# Altium project sync.PrjPcb
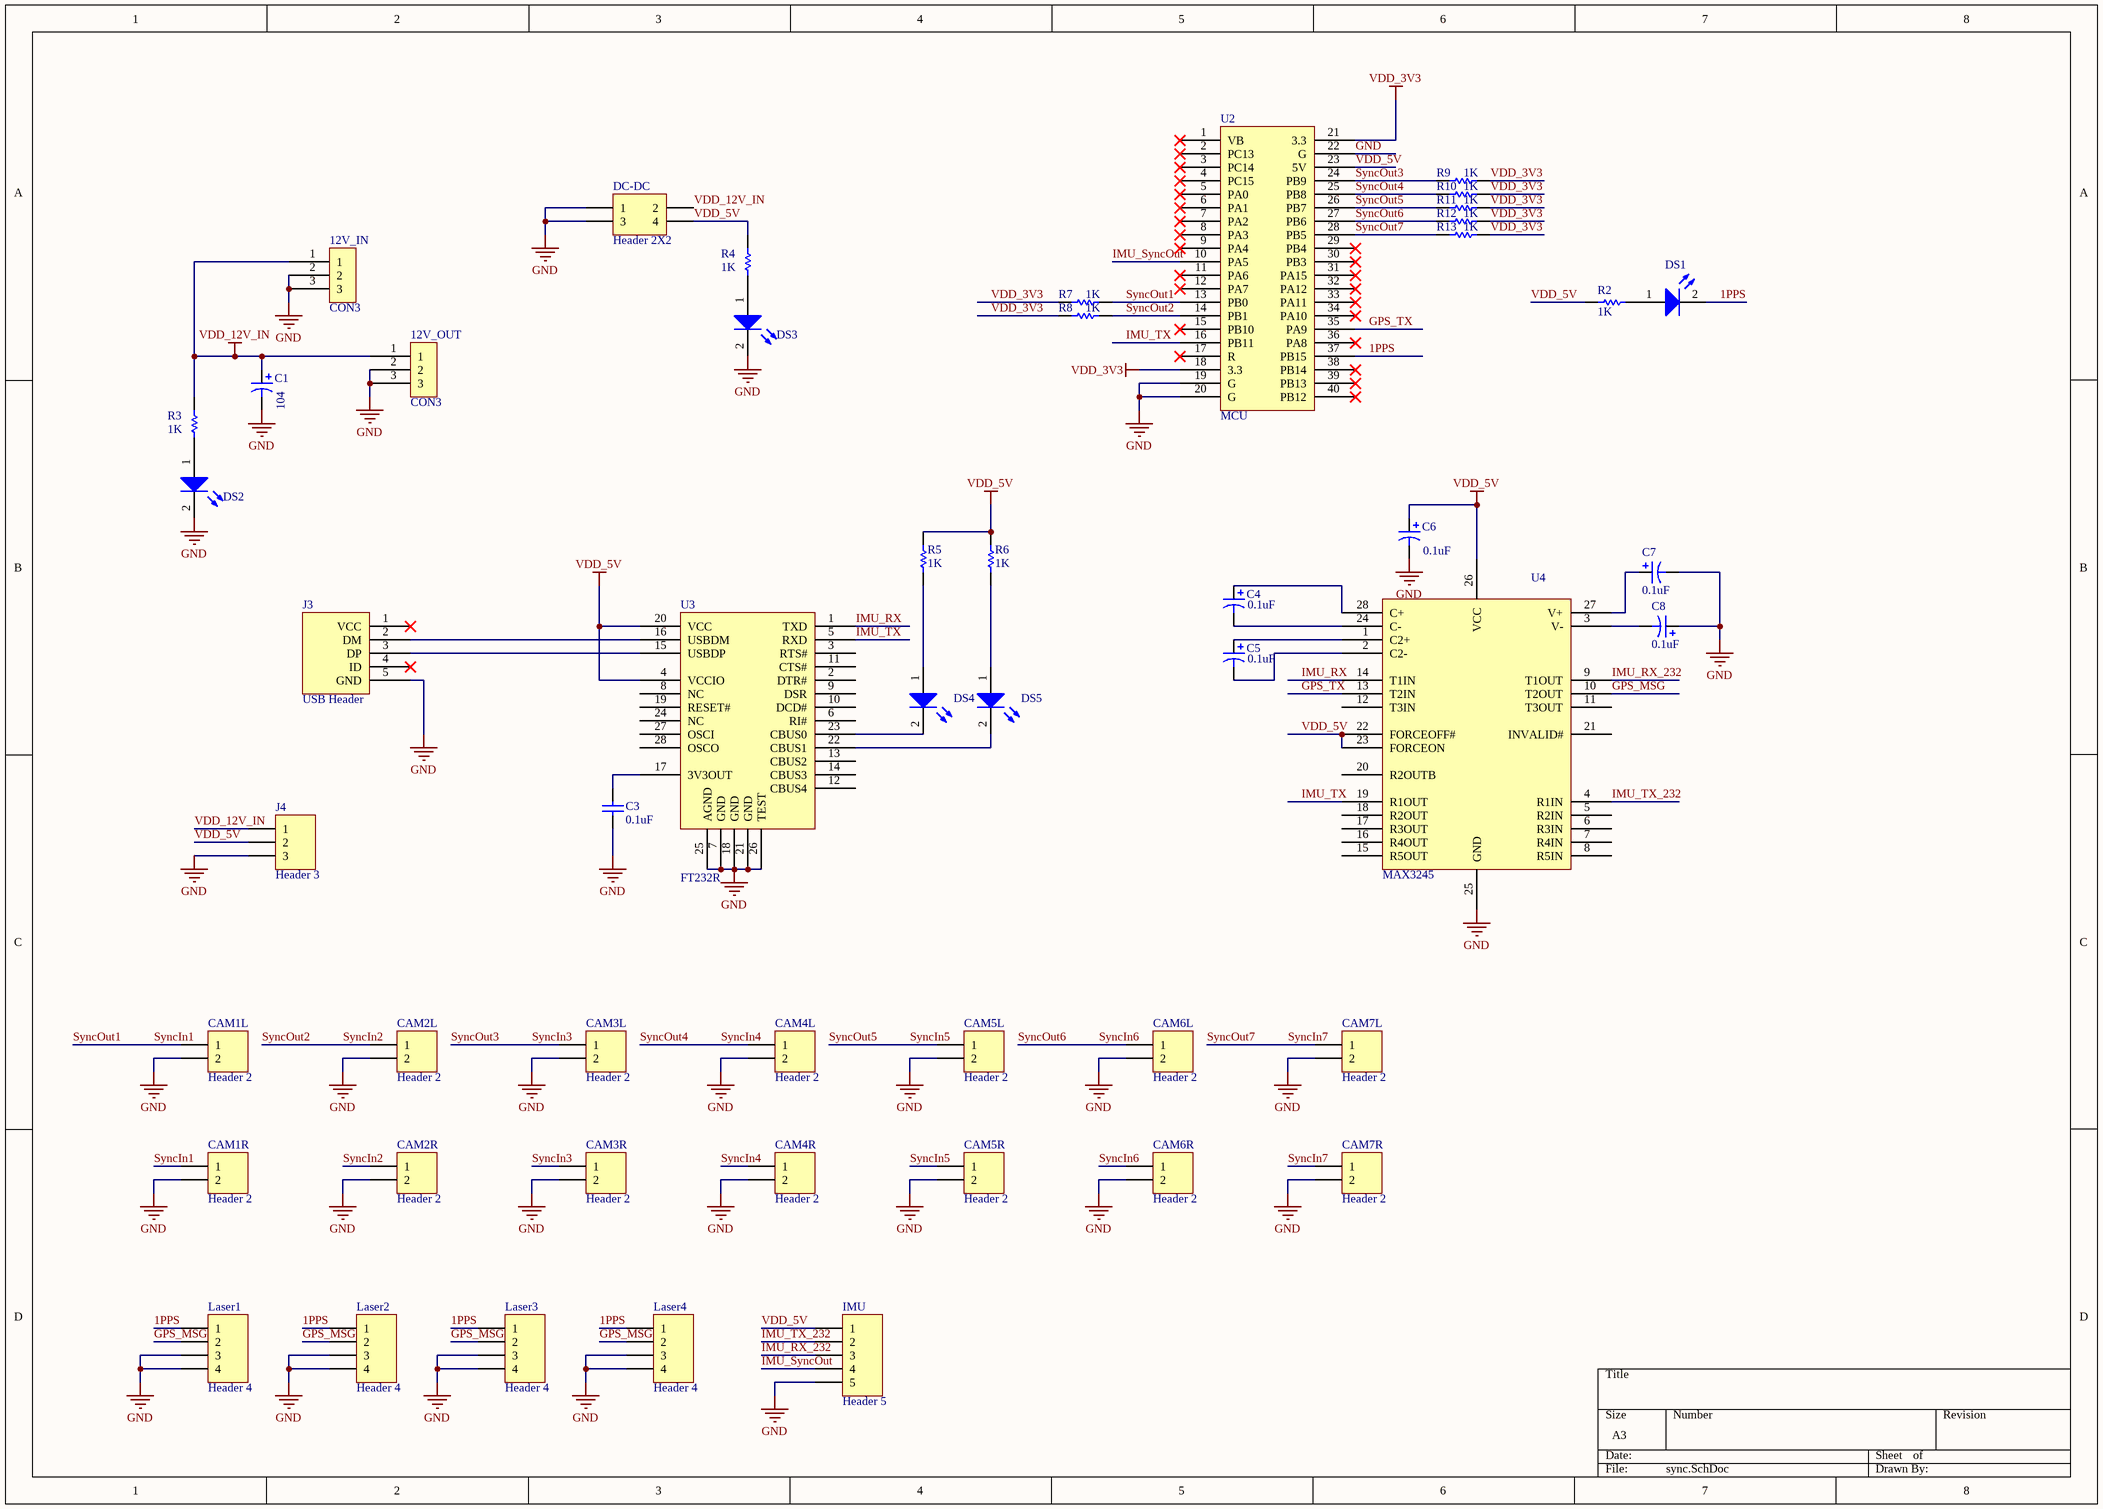
[diagram p0: sync.SchDoc]
1 sheet, 51 parts. Net scope: global (net labels, ports and power ports of the same name join across sheets).
Board file: sync.PcbDoc

## Sheet sync.SchDoc
size A3

### Parts
12V_IN  CON3  [PW_PORT]
12V_OUT  CON3  [PW_PORT]
C1  104  [0805]
C3  0.1uF  [0805C]
C4  0.1uF  [C1206]
C5  0.1uF  [C1206]
C6  0.1uF  [C1206]
C7  0.1uF  [C1206]
C8  0.1uF  [C1206]
CAM1L  Header 2  [1.25mmP2]
CAM1R  Header 2  [1.25mmP2]
CAM2L  Header 2  [1.25mmP2]
CAM2R  Header 2  [1.25mmP2]
CAM3L  Header 2  [1.25mmP2]
CAM3R  Header 2  [1.25mmP2]
CAM4L  Header 2  [1.25mmP2]
CAM4R  Header 2  [1.25mmP2]
CAM5L  Header 2  [1.25mmP2]
CAM5R  Header 2  [1.25mmP2]
CAM6L  Header 2  [1.25mmP2]
CAM6R  Header 2  [1.25mmP2]
CAM7L  Header 2  [1.25mmP2]
CAM7R  Header 2  [1.25mmP2]
DC-DC  Header 2X2  [DC-DC5V_HDR2*2]
DS1  LED2  [0805D]  (value not drawn)
DS2  LED2  [0805D]  (value not drawn)
DS3  LED2  [0805D]  (value not drawn)
DS4  LED2  [0805D]  (value not drawn)
DS5  LED2  [0805D]  (value not drawn)
IMU  Header 5  [1.25mmP5]
J3  USB Header  [USB0.65-5]
J4  Header 3  [HDR1X3]
Laser1  Header 4  [1.25mmP4]
Laser2  Header 4  [1.25mmP4]
Laser3  Header 4  [1.25mmP4]
Laser4  Header 4  [1.25mmP4]
R2  1K  [0805R]
R3  1K  [0805R]
R4  1K  [0805R]
R5  1K  [0805R]
R6  1K  [0805R]
R7  1K  [0805R]
R8  1K  [0805R]
R9  1K  [0805R]
R10  1K  [0805R]
R11  1K  [0805R]
R12  1K  [0805R]
R13  1K  [0805R]
U2  MCU  [STM32Board]
U3  FT232R  [SSOP-28]
U4  MAX3245  [SSOP-28]

### Nets
GND: 12V_IN.2 12V_IN.3 12V_OUT.2 12V_OUT.3 C1.2 C3.1 C6.2 C7.2 C8.1 CAM1L.2 CAM1R.2 CAM2L.2 CAM2R.2 CAM3L.2 CAM3R.2 CAM4L.2 CAM4R.2 CAM5L.2 CAM5R.2 CAM6L.2 CAM6R.2 CAM7L.2 CAM7R.2 DC-DC.1 DC-DC.3 DS2.2(K) DS3.2(K) IMU.5 J3.5(GND) J4.3 Laser1.3 Laser1.4 Laser2.3 Laser2.4 Laser3.3 Laser3.4 Laser4.3 Laser4.4 U2.19(G) U2.20(G) U2.22(G) U3.7(GND) U3.18(GND) U3.21(GND) U3.25(AGND) U3.26(TEST) U4.25(GND)
VDD_3V3: R7.2 R8.2 R9.1 R10.1 R11.1 R12.1 R13.1 U2.18(3.3) U2.21(3.3)
VDD_5V: C6.1 DC-DC.4 IMU.1 J4.2 R2.2 R4.2 R5.1 R6.1 U2.23(5V) U3.4(VCCIO) U3.20(VCC) U4.22(FORCEOFF#) U4.23(FORCEON) U4.26(VCC)
VDD_12V_IN: 12V_IN.1 12V_OUT.1 C1.1 DC-DC.2 J4.1 R3.2
1PPS: DS1.2(K) Laser1.1 Laser2.1 Laser3.1 Laser4.1 U2.37(PB15)
GPS_MSG: Laser1.2 Laser2.2 Laser3.2 Laser4.2 U4.10(T2OUT)
GPS_TX: U2.35(PA9) U4.13(T2IN)
IMU_RX: U3.1(TXD) U4.14(T1IN)
IMU_RX_232: IMU.3 U4.9(T1OUT)
IMU_SyncOut: IMU.4 U2.10(PA5)
IMU_TX: U2.16(PB11) U3.5(RXD) U4.19(R1OUT)
IMU_TX_232: IMU.2 U4.4(R1IN)
SyncIn1: CAM1L.1 CAM1R.1 R7.1 U2.13(PB0)  [also labelled SyncOut1]
SyncIn2: CAM2L.1 CAM2R.1 R8.1 U2.14(PB1)  [also labelled SyncOut2]
SyncIn3: CAM3L.1 CAM3R.1 R9.2 U2.24(PB9)  [also labelled SyncOut3]
SyncIn4: CAM4L.1 CAM4R.1 R10.2 U2.25(PB8)  [also labelled SyncOut4]
SyncIn5: CAM5L.1 CAM5R.1 R11.2 U2.26(PB7)  [also labelled SyncOut5]
SyncIn6: CAM6L.1 CAM6R.1 R12.2 U2.27(PB6)  [also labelled SyncOut6]
SyncIn7: CAM7L.1 CAM7R.1 R13.2 U2.28(PB5)  [also labelled SyncOut7]
NetC3_2: C3.2 U3.17(3V3OUT)
NetC4_1: C4.1 U4.28(C+)
NetC4_2: C4.2 U4.24(C-)
NetC5_1: C5.1 U4.1(C2+)
NetC5_2: C5.2 U4.2(C2-)
NetC7_1: C7.1 U4.27(V+)
NetC8_2: C8.2 U4.3(V-)
NetDS1_1: DS1.1(A) R2.1
NetDS2_1: DS2.1(A) R3.1
NetDS3_1: DS3.1(A) R4.1
NetDS4_1: DS4.1(A) R5.2
NetDS4_2: DS4.2(K) U3.23(CBUS0)
NetDS5_1: DS5.1(A) R6.2
NetDS5_2: DS5.2(K) U3.22(CBUS1)
NetJ3_2: J3.2(DM) U3.16(USBDM)
NetJ3_3: J3.3(DP) U3.15(USBDP)

Not connected (* = marked no-connect by the designer): J3 1(VCC)* 4(ID)*; U2 1(VB)* 2(PC13)* 3(PC14)* 4(PC15)* 5(PA0)* 6(PA1)* 7(PA2)* 8(PA3)* 9(PA4)* 11(PA6)* 12(PA7)* 15(PB10)* 17(R)* 29(PB4)* 30(PB3)* 31(PA15)* 32(PA12)* 33(PA11)* 34(PA10)* 36(PA8)* 38(PB14)* 39(PB13)* 40(PB12)*; U3 2(DTR#) 3(RTS#) 6(RI#) 8(NC) 9(DSR) 10(DCD#) 11(CTS#) 12(CBUS4) 13(CBUS2) 14(CBUS3) 19(RESET#) 24(NC) 27(OSCI) 28(OSCO); U4 5(R2IN) 6(R3IN) 7(R4IN) 8(R5IN) 11(T3OUT) 12(T3IN) 15(R5OUT) 16(R4OUT) 17(R3OUT) 18(R2OUT) 20(R2OUTB) 21(INVALID#)

### Library data of the parts
C1 C4-C8 = Cap Pol3: Polarized Capacitor (Surface Mount); Published: 8-Jun-2000; LatestRevisionDate: 17-Jul-2002; LatestRevisionNote: Re-released for DXP Platform.; PackageReference: C0805; Publisher: Altium Limited
C3 = Cap: Capacitor; Published: 8-Jun-2000; LatestRevisionDate: 17-Jul-2002; LatestRevisionNote: Re-released for DXP Platform.; Publisher: Altium Limited; Value: 0.1uF
CAM1L CAM1R CAM2L CAM2R CAM3L CAM3R CAM4L CAM4R CAM5L CAM5R CAM6L CAM6R CAM7L CAM7R = Header 2: Header, 2-Pin; LatestRevisionDate: 17-Jul-2002; LatestRevisionNote: Re-released for DXP Platform.; Publisher: Altium Limited
DC-DC = Header 2X2: Header, 2-Pin, Dual row; LatestRevisionDate: 17-Jul-2002; LatestRevisionNote: Re-released for DXP Platform.; Publisher: Altium Limited
DS1-DS5 = LED2: Typical RED, GREEN, YELLOW, AMBER GaAs LED; Manufacturer: Generic Components; Class: Optoelectronic; Published: 08/06/2000; Publisher: Altium Hobart Technology Centre; SubClass: LED
IMU = Header 5: Header, 5-Pin; LatestRevisionDate: 17-Jul-2002; LatestRevisionNote: Re-released for DXP Platform.; Publisher: Altium Limited
J3 = USB
J4 = Header 3: Header, 3-Pin; LatestRevisionDate: 17-Jul-2002; LatestRevisionNote: Re-released for DXP Platform.; Publisher: Altium Limited
Laser1-Laser4 = Header 4: Header, 4-Pin; LatestRevisionDate: 17-Jul-2002; LatestRevisionNote: Re-released for DXP Platform.; Publisher: Altium Limited
R2-R13 = Res1: Resistor; Manufacturer: Generic Components; Class: Passive; Published: 08/06/2000; Publisher: Altium Hobart Technology Centre; SubClass: Resistor; Value: 1K